# Altium schematic sheet [2] IMD_Input_Stage.SchDoc
size A3
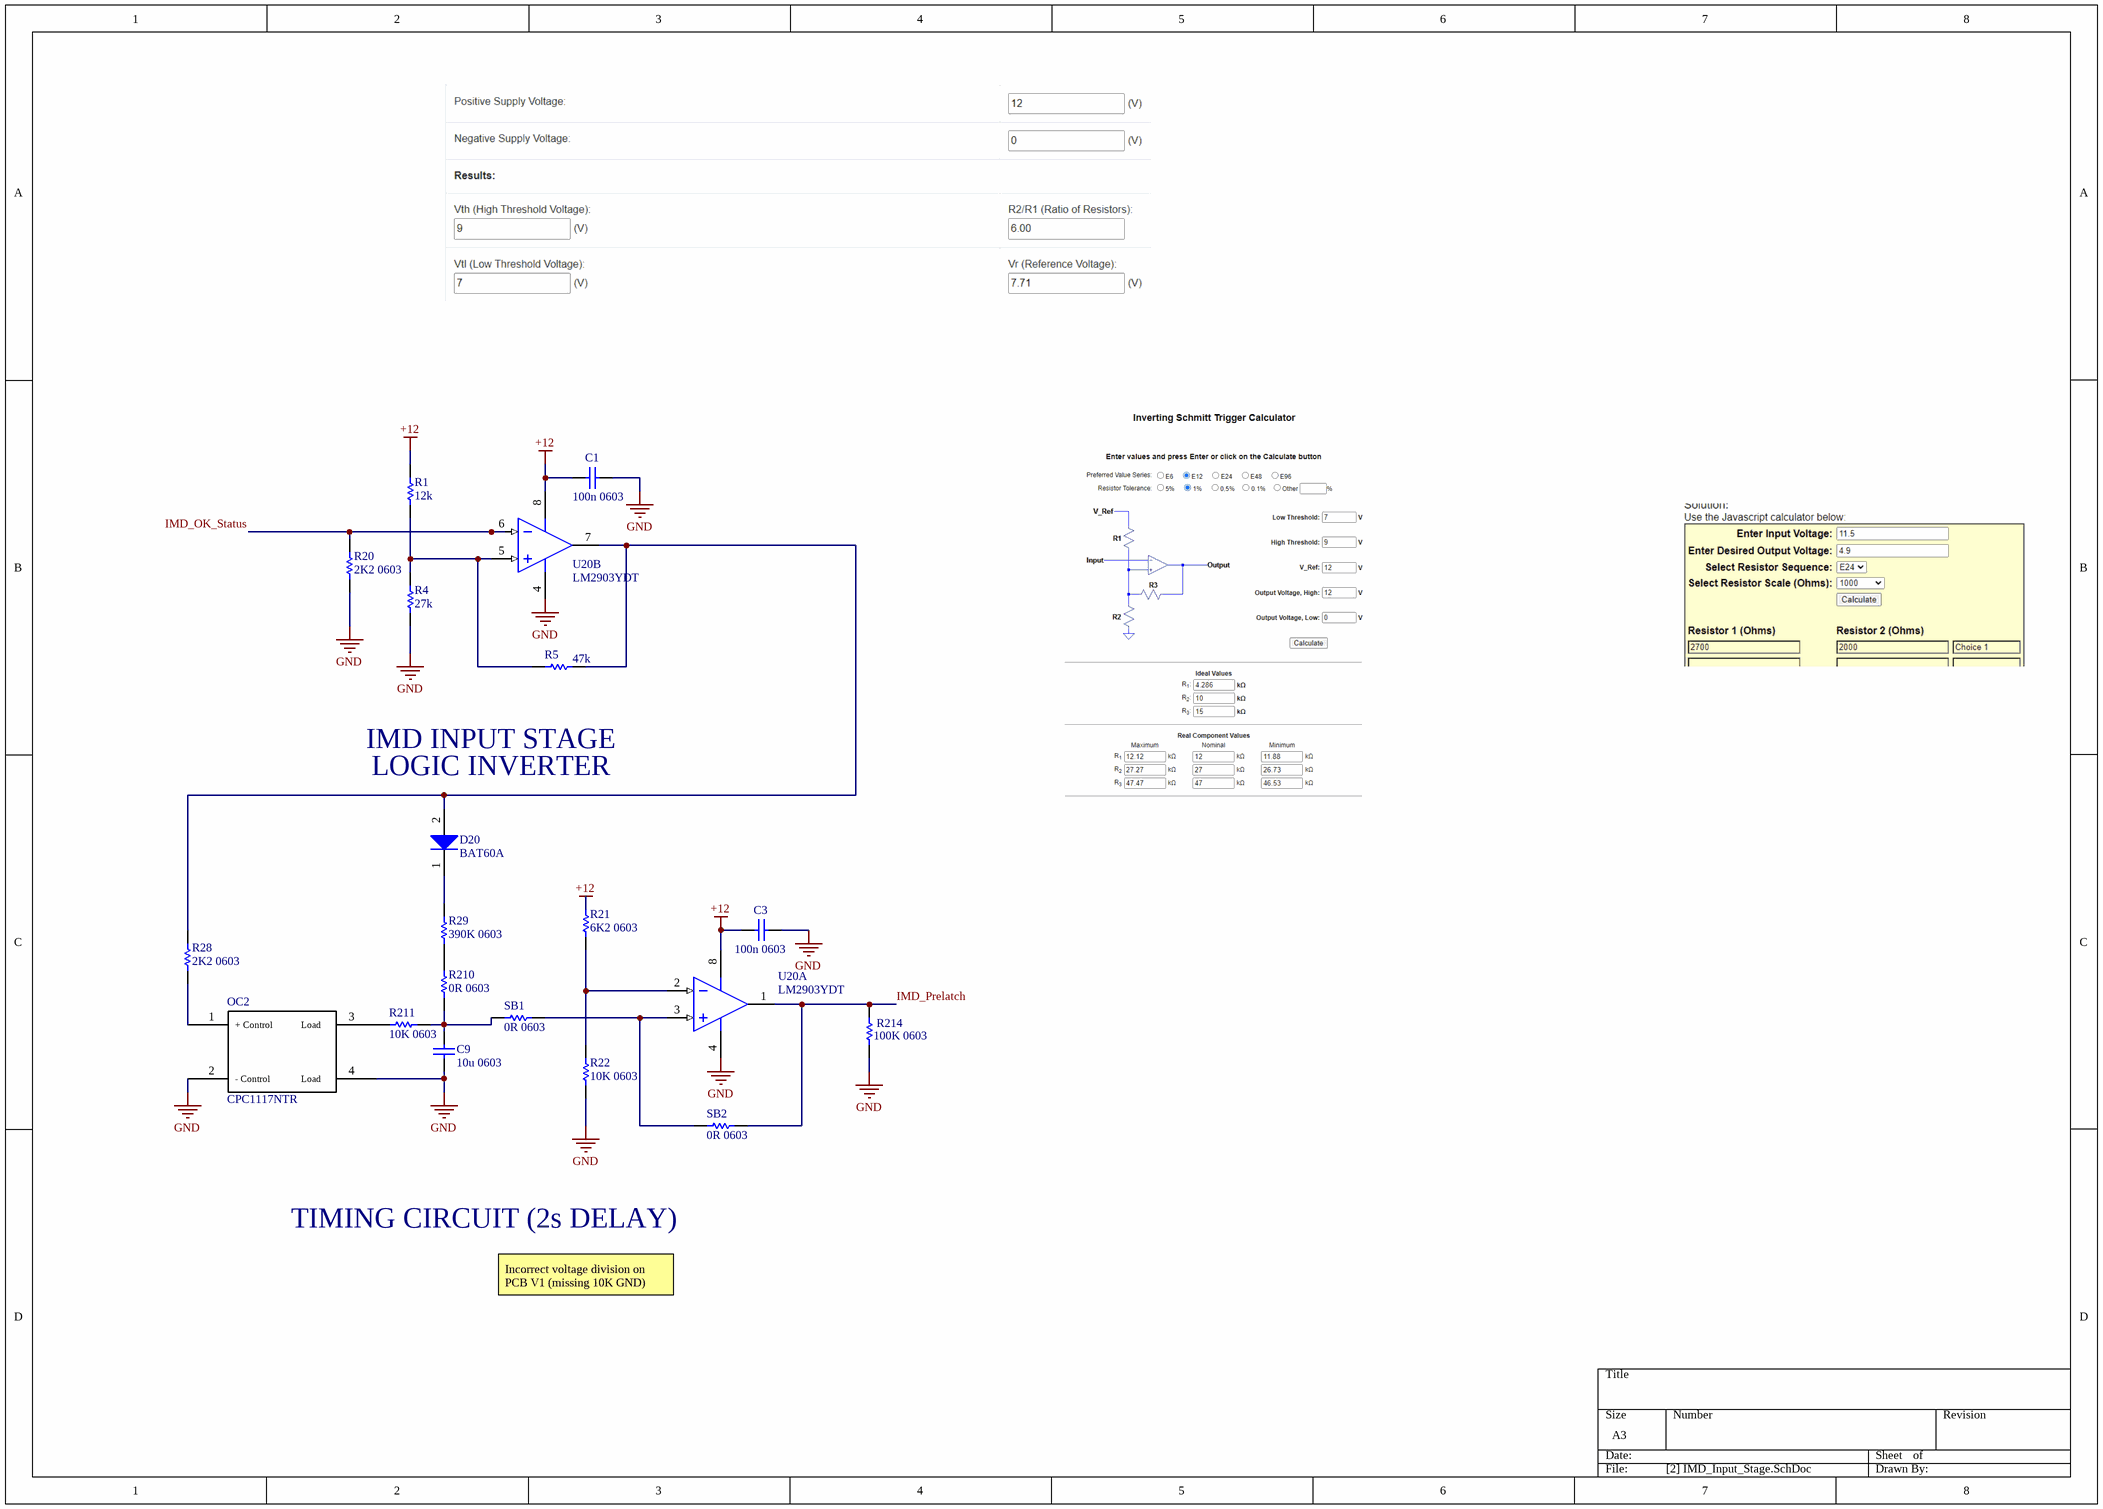
[diagram p0: [2] IMD_Input_Stage.SchDoc]

## Parts
C1  100n 0603  [CAPC0603(1608)100_M]
C3  100n 0603  [CAPC0603(1608)100_M]
C9  10u 0603  [CAPC0603(1608)100_M]
D20  BAT60A  [INF-SOD323_V]
OC2  CPC1117NTR  [SOP-4 (CPC1117NTR)]
R1  12k  [RESC1608X55X25NL10T15]
R4  27k  [RESC1608X55X25LL10T15]
R5  47k  [RESC1608X55X30NL15T15]
R20  2K2 0603  [CAPC0603(1608)100_M]
R21  6K2 0603  [CAPC0603(1608)100_M]
R22  10K 0603  [CAPC0603(1608)100_M]
R28  2K2 0603  [CAPC0603(1608)100_M]
R29  390K 0603  [CAPC0603(1608)100_M]
R210  0R 0603  [CAPC0603(1608)100_M]
R211  10K 0603  [CAPC0603(1608)100_M]
R214  100K 0603  [CAPC0603(1608)100_M]
SB1  0R 0603  [CAPC0603(1608)100_M]
SB2  0R 0603  [CAPC0603(1608)100_M]
U20  LM2903YDT  [ONSC-SOIC-8-751-07_V]  (parts A,B of 2)

## Nets
+12: C1.1 C3.1 R1.1 R21.1 U20.8(VCC)
GND: C1.2 C3.2 C9.2 OC2.2 OC2.4 R4.1 R20.2 R22.2 R214.2 U20.4(GND)
IMD_OK_Status: R20.1 U20.6(INB-)
IMD_Prelatch: R214.1 SB2.2 U20.1(OUTA)
NetC9_1: C9.1 R210.2 R211.2 SB1.1
NetD20_1: D20.1(K) R29.1
NetD20_2: D20.2(A) R5.2 R28.1 U20.7(OUTB)
NetOC2_1: OC2.1 R28.2
NetOC2_3: OC2.3 R211.1
NetR1_2: R1.2 R4.2 R5.1 U20.5(INB+)
NetR21_2: R21.2 R22.1 U20.2(INA-)
NetR29_2: R29.2 R210.1
NetSB1_2: SB1.2 SB2.1 U20.3(INA+)

## Notes on the sheet
- IMD INPUT STAGE
- LOGIC INVERTER
- TIMING CIRCUIT (2s DELAY)
- Incorrect voltage division on PCB V1 (missing 10K GND)
- (in symbol CPC1117NTR) + Control; Load; - Control

## Library data of the parts
C1 C3 = Cap: Capacitor; Value: 100nF; Published: 8-Jun-2000; LatestRevisionDate: 17-Jul-2002; LatestRevisionNote: Re-released for DXP Platform.; PackageReference: RAD-0.3; Publisher: Altium Limited; PackageDescription: Radial Cap, Thru-Hole; 2 Leads; 0.3 in Pin Spacing
C9 = Cap: Capacitor; Value: 10uF; Published: 8-Jun-2000; LatestRevisionDate: 17-Jul-2002; LatestRevisionNote: Re-released for DXP Platform.; PackageReference: RAD-0.3; Publisher: Altium Limited; PackageDescription: Radial Cap, Thru-Hole; 2 Leads; 0.3 in Pin Spacing
D20 = CMP-1183-00008-2: Silicon Schottky Diode, -55 to 85 degC, SOD323, Reel, Green; Manufacturer: Infineon; Green: TRUE; VR (max): 10Â V; IF (max): 3,000Â mA; VF (max): 370Â mV; CT (max): 35Â pF; Configuration: Single; PackageDescription: 3-Pin Small Outline Transistor Package, 1.25 x 2 mm Body, 0.65 mm Pitch; PartNumber: BAT60A; Mounting Technology: Surface Mount; PackageReference: SOT323; ComponentLink1Description: Manufacturer URL; Packing: Reel; ComponentLink3URL: http://www.infineon.com/dgdl/SOT323-Package_Overview.pdf?folderId=db3a30431936bc4b0119533e1dcb3c92&fileId=db3a30431936bc4b011953495f283cb1; ComponentLink2URL: http://www.infineon.com/dgdl/bat60aseries.pdf?folderId=db3a304313d846880113def5812204a1&fileId=db3a304313d846880113def70c9304a9; ComponentLink1URL: http://www.infineon.com/; ComponentLink2Description: Datasheet; ComponentLink3Description: Package Specification
R1 = CMP-1659-00047-1: Chip Resistor, 12 KOhm, +/- 1%, 100 mW, -55 to 155 degC, 0603 (1608 Metric), RoHS, Tape and Reel; Voltage Rating: 50 V; Case\Package: 0603; Resistance: 220 kohm; Power Rating: 100 mW; Package Quantity: 5000; Mount: Surface Mount; ComponentLink2Description: Datasheet; Min Operating Temperature: -55 degC; ComponentLink1Description: Manufacturer URL; Pins: 2; Case Code (Imperial): 0603; PackageDescription: 2-Pin Surface Mount Device, Body 1.6 x 0.8 mm; Voltage Rating (DC): 50 V; Width: 0.8 mm; ComponentLink1URL: http://www.yageo.com/; Case Code (Metric): 1608; Packaging: Tape and Reel; Height: 0.45 mm; REACH SVHC: No SVHC; DatasheetVersion: Rev. 4, 02/2016; Max Operating Temperature: 155 degC; RoHSCompliant: true; Length: 1.6 mm; Tolerance: 1%; PackageReference: 0603; ComponentLink2URL: http://www.yageo.com/documents/recent/PYu-RC_Group_51_RoHS_L_04.pdf
R4 = CMP-2000-06933-1: Chip Resistor, 27 KOhm, +/- 1%, 0.1 W, -55 to 155 degC, 0603 (1608 Metric), RoHS, Tape and Reel; Manufacturer: Yageo; Resistance: 27kOhms; Temperature Coefficient: 100PPM/C; Power Rating: 100mW; Voltage Rating: 50V; Mounting Technology: SurfaceMount; Operating Temperature Range: -55Cto+155C; Case Code - in: 0603; Product: ThickFilmResistorsGeneralPurpose; Package Reference: 0603; Datasheet Version: Rev. 7, 05/2017; Tolerance: 1%; Manufacturer URL: http://www.yageo.com/; Termination Style: SMD/SMT; Packaging: Reel; Series: RC; Package Description: 2-Pin Surface Mount Device, Body 1.6 x 0.8 mm; Datasheet URL: http://www.yageo.com/documents/recent/PYu-RC_Group_51_RoHS_L_7.pdf; Case Code - mm: 1608
R5 = CMP-2000-00523-2: Chip Resistor, 47 KOhm, +/- 1%, 0.1 W, -55 to 155 degC, 0603 (1608 Metric), RoHS, Tape and Reel; Case\Package: 0603; Forward Current: 20 mA; Power Rating: 90 mW; Illumination Colour: Red; Nominal Vf: 2.1 V; Viewing Angle: 160 degrees; Luminous Intensity: 63 mcd; Lens Style: Clear; Nominal Wavelength: 639 nm; Case Code (Imperial): 0603; Case Code (Metric): 1608; Packaging: Tape and Reel; Radiation Hardening: No; Colour: Red; PackageDescription: 2-Pin Surface Mount Device, Body 1.6 x 0.85 mm; ComponentLink1Description: Manufacturer URL; Width: 0.8 mm; DatasheetVersion: Apr-15; ComponentLink2URL: http://industrial.panasonic.com/cdbs/www-data/pdf/RDA0000/AOA0000C86.pdf; Min Operating Temperature: -40 degC; Height: 0.6 mm; Package Quantity: 3000; ComponentLink2Description: Datasheet; REACH SVHC: No SVHC; ComponentLink1URL: http://www.panasonic.com/; Mount: Surface Mount; RoHSCompliant: true; Max Operating Temperature: 100 degC; PackageReference: 0603; Length: 1.6 mm; Forward Voltage: 2.1 V; Pins: 2
R20-R22 R28 R29 R210 R211 R214 = Res1: Resistor; Published: 8-Jun-2000; LatestRevisionDate: 17-Jul-2002; LatestRevisionNote: Re-released for DXP Platform.; PackageReference: AXIAL-0.3; Publisher: Altium Limited; PackageDescription: Axial Device, Thru-Hole; 2 Leads; 0.3 in Pin Spacing
  R20 R28: Value: 2K2
  R21: Value: 6K2
  R22 R211: Value: 10K
  R29: Value: 390K
  R210: Value: 0R
  R214: Value: 100K
SB1 SB2 = Res1: Resistor; Value: Bridge; Published: 8-Jun-2000; LatestRevisionDate: 17-Jul-2002; LatestRevisionNote: Re-released for DXP Platform.; PackageReference: AXIAL-0.3; Publisher: Altium Limited; PackageDescription: Axial Device, Thru-Hole; 2 Leads; 0.3 in Pin Spacing
U20 = CMP-1305-00052-1: JL 10/9/19: LM2903DR2G model used. / Low Offset Voltage Dual Comparators, 2 to 36 V, -40 to 105 degC, 8-Pin SOIC, Pb-Free, Tape and Reel; Manufacturer: On Semiconductor; VCC Min (V): 2; ICC Typ (mA): 0.4; VCC Max (V): 36; IO Typ (mA): 16; RoHS: TRUE; Mounting Technology: Surface Mount; PackageVersion: Rev. AK, 02/2011; ComponentLink2Description: Datasheet; PackageReference: SOIC-8-751-07; ComponentLink2URL: http://www.onsemi.com/pub_link/Collateral/LM393-D.PDF; ComponentLink1URL: http://www.onsemi.com/; ComponentLink3URL: http://www.onsemi.com/pub_link/Collateral/751-07.PDF; ComponentLink1Description: Manufacturer URL; DatasheetVersion: Rev. 25; PartNumber: LM2903DR2G; Packing: Tape and Reel; ComponentLink3Description: Package Specification; PackageDescription: 8-Pin Small Outline Integrated Circuit, Body 4.9 x 3.9 mm, Pitch 1.27 mm